# EasyEDA Pro project 延时继电器 - V2.eprj, schematic 原理图
Board Name: 转接隔离板; Create Date: 2024-04-22; Page Name: 主控MCU; Project Name: 延时继电器; Schematic Name: 原理图; Update Date: 2025-04-25; Company: 嘉立创EDA; Page Size: A3; Version: V1.0
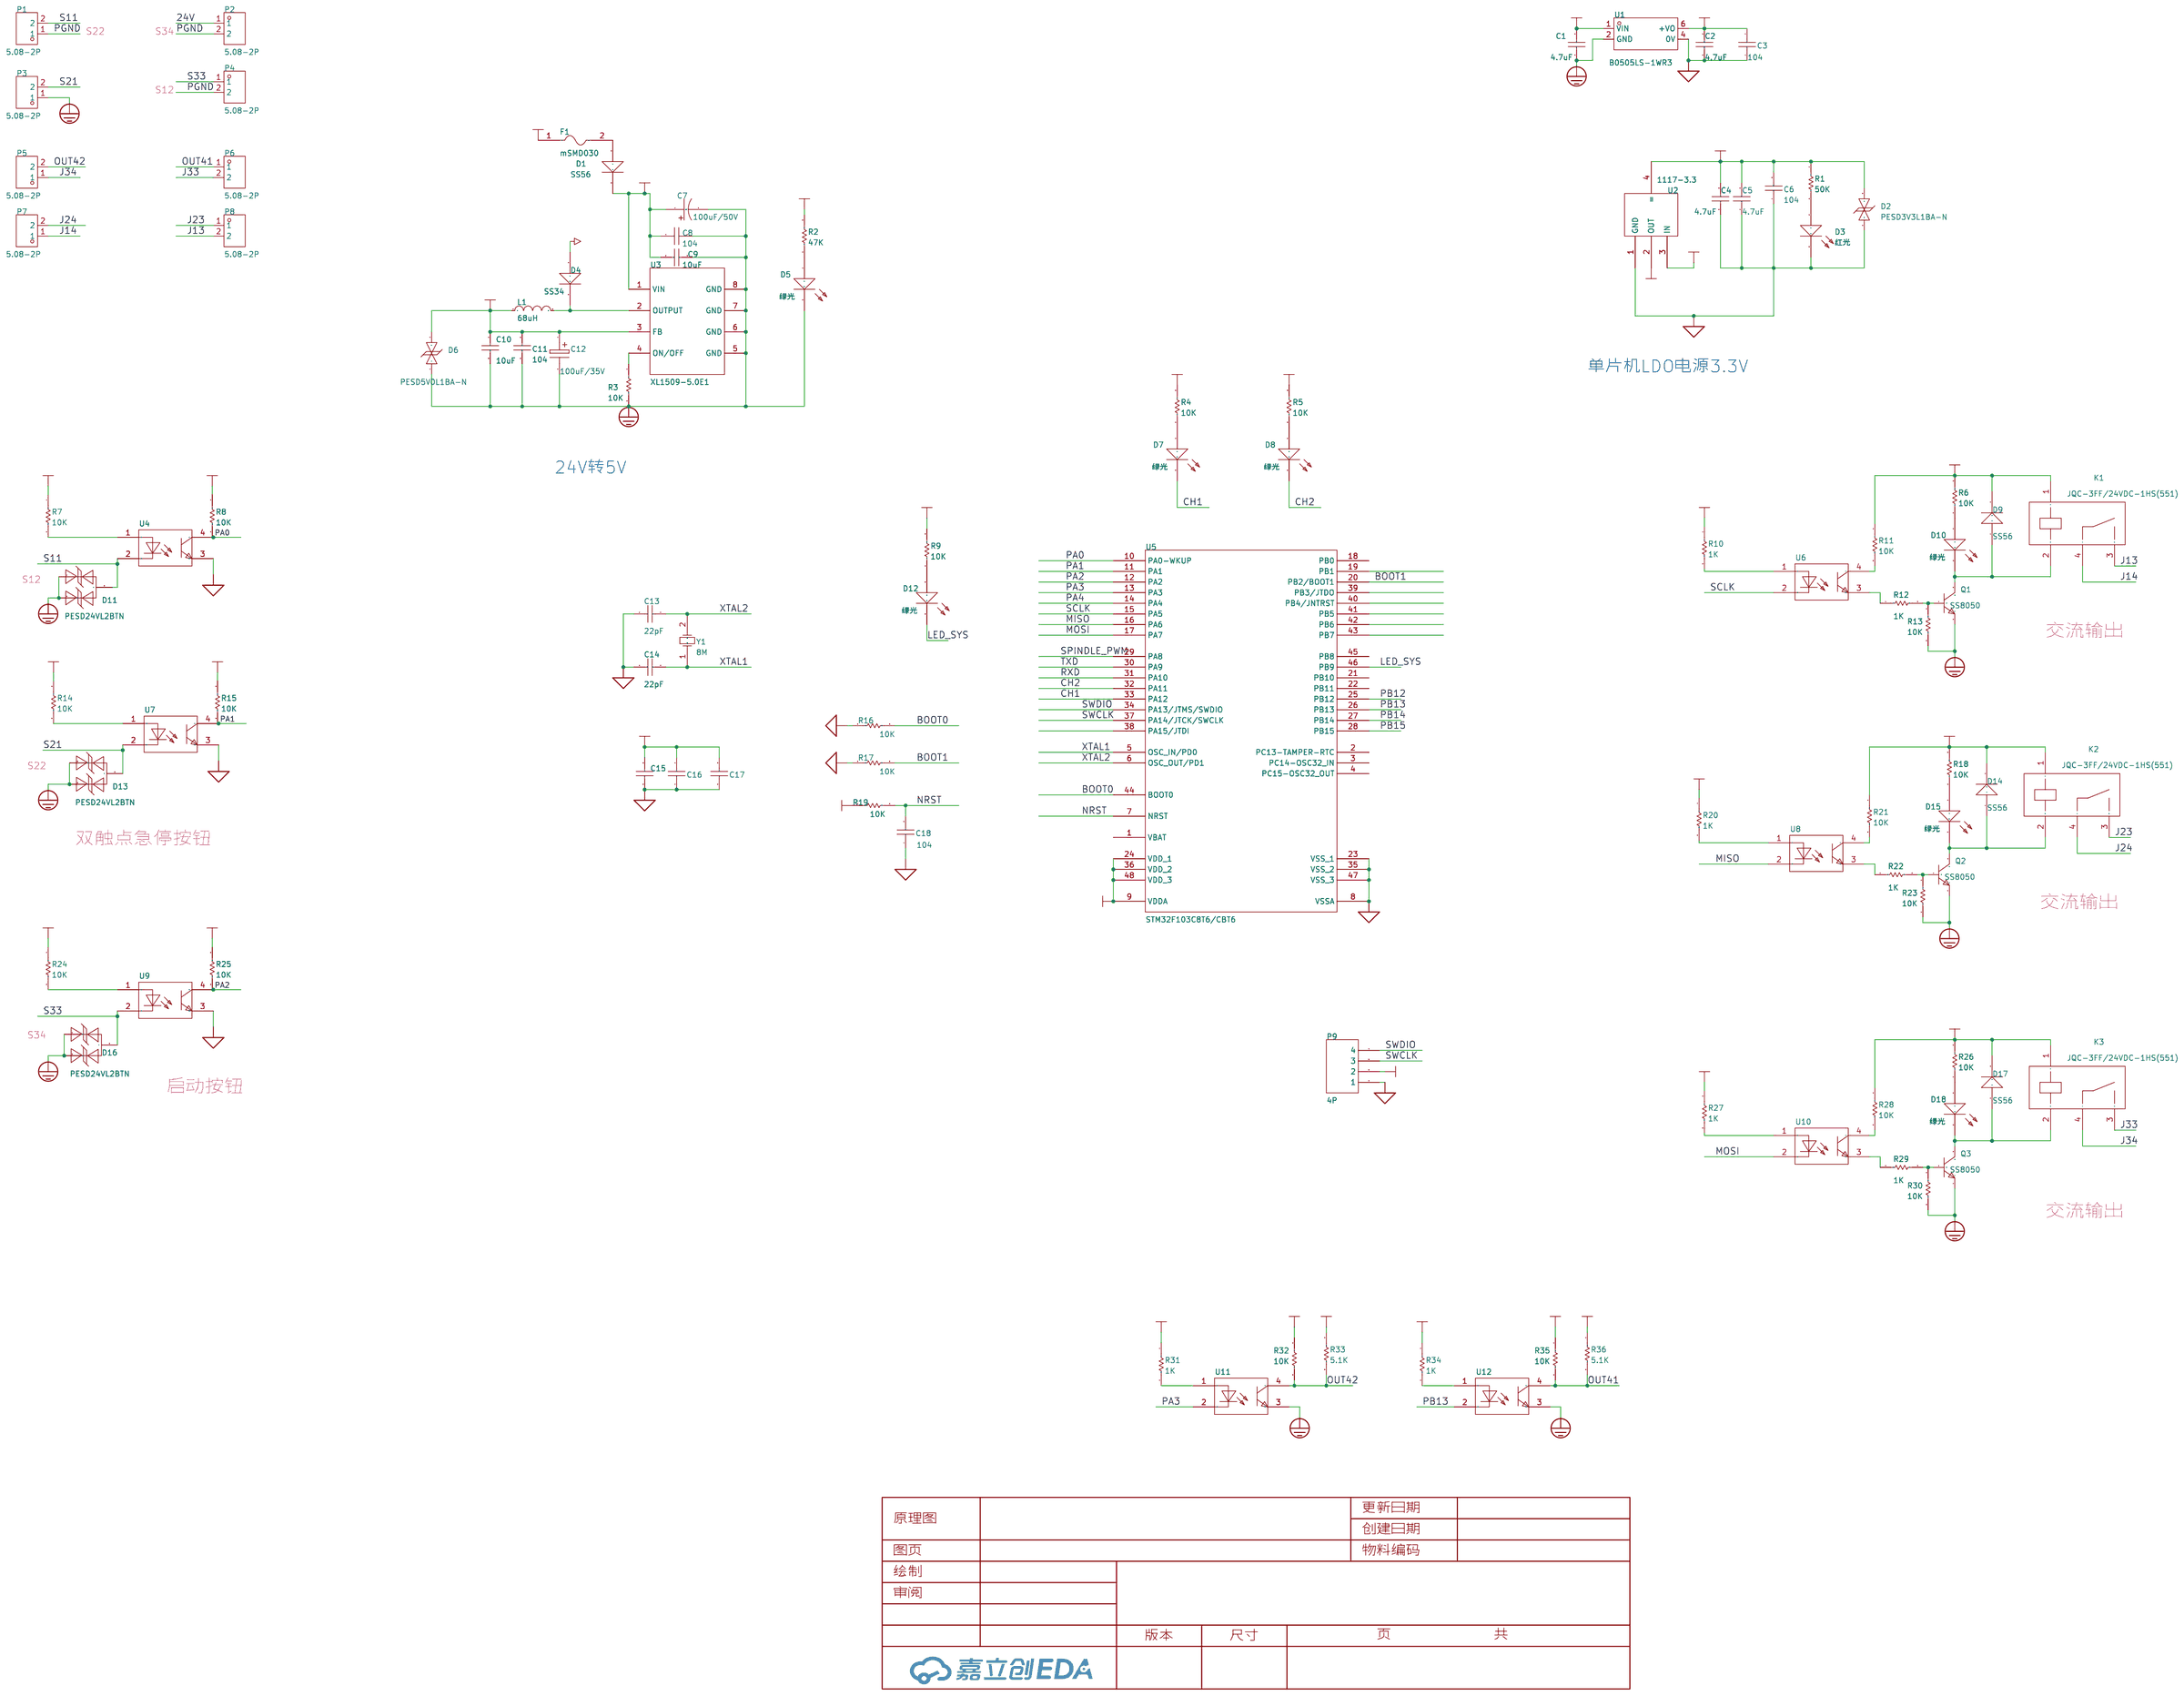
[diagram p0: schematic sheet]

## Parts
C1  4.7uF  [C1206]
C2  4.7uF  [C1206]
C3  104  [C0603]
C4  4.7uF  [C1206]
C5  4.7uF  [C1206]
C6  104  [0603C]
C7  100uF/50V  [CAP-SMD_BD10.0-L10.3-W10.3-LS11.0-R-RD]
C8  104  [0603C]
C9  10uF  [C1206]
C10  10uF  [C1206]
C11  104  [0603C]
C12  100uF/35V  [电解电容贴片6X6]
C13  100pF  [0603C]
C14  100pF  [0603C]
C15  104  [0603C]
C16  104  [0603C]
C17  104  [0603C]
C18  104  [0603C]
D1  SS56  [SMA]
D2  PESD3V3L1BA-N  [SOD-323_L1.8-W1.3-LS2.5-BI]
D3  红光  [0603LED]
D4  SS34  [SMA]
D5  绿光  [0603LED]
D6  PESD5V0L1BA-N  [SOD-323_L1.8-W1.3-LS2.5-BI]
D7  绿光  [0603LED]
D8  绿光  [0603LED]
D9  SS56  [SMA]
D10  绿光  [0603LED]
D11  PESD24VL2BTN  [SOT-23-3_L2.9-W1.6-P1.90-LS2.8-BR]
D12  绿光  [0603LED]
D13  PESD24VL2BTN  [SOT-23-3_L2.9-W1.6-P1.90-LS2.8-BR]
D14  SS56  [SMA]
D15  绿光  [0603LED]
D16  PESD24VL2BTN  [SOT-23-3_L2.9-W1.6-P1.90-LS2.8-BR]
D17  SS56  [SMA]
D18  绿光  [0603LED]
F1  mSMD030  [F1812]
K1  JQC-3FF/24VDC-1HS(551)  [RELAY-TH_JQC-3FF-1HXX]
K2  JQC-3FF/24VDC-1HS(551)  [RELAY-TH_JQC-3FF-1HXX]
K3  JQC-3FF/24VDC-1HS(551)  [RELAY-TH_JQC-3FF-1HXX]
L1  68uH  [IND-SMD_L7.0-W7.0_SMDRI74-330MT]
P1  5.08-2P  [CONN-TH_2P-P5.08_DB128L-5.08-2P]
P2  5.08-2P  [CONN-TH_2P-P5.08_DB128L-5.08-2P]
P3  5.08-2P  [CONN-TH_2P-P5.08_DB128L-5.08-2P]
P4  5.08-2P  [CONN-TH_2P-P5.08_DB128L-5.08-2P]
P5  5.08-2P  [CONN-TH_2P-P5.08_DB128L-5.08-2P]
P6  5.08-2P  [CONN-TH_2P-P5.08_DB128L-5.08-2P]
P7  5.08-2P  [CONN-TH_2P-P5.08_DB128L-5.08-2P]
P8  5.08-2P  [CONN-TH_2P-P5.08_DB128L-5.08-2P]
P9  4P  [SIP4]
Q1  SS8050  [SOT-23-3_L2.9-W1.3-P1.90-LS2.4-BR]
Q2  SS8050  [SOT-23-3_L2.9-W1.3-P1.90-LS2.4-BR]
Q3  SS8050  [SOT-23-3_L2.9-W1.3-P1.90-LS2.4-BR]
R1  50K  [0603R]
R2  47K  [0603R]
R3  10K  [0603R]
R4  10K  [0603R]
R5  10K  [0603R]
R6  10K  [0603R]
R7  10K  [0603R]
R8  10K  [0603R]
R9  10K  [0603R]
R10  1K  [0603R]
R11  10K  [0603R]
R12  1K  [0603R]
R13  10K  [0603R]
R14  10K  [0603R]
R15  10K  [0603R]
R16  10K  [0603R]
R17  10K  [0603R]
R18  10K  [0603R]
R19  10K  [0603R]
R20  1K  [0603R]
R21  10K  [0603R]
R22  1K  [0603R]
R23  10K  [0603R]
R24  10K  [0603R]
R25  10K  [0603R]
R26  10K  [0603R]
R27  1K  [0603R]
R28  10K  [0603R]
R29  1K  [0603R]
R30  10K  [0603R]
R31  1K  [0603R]
R32  10K  [0603R]
R33  10K  [0603R]
R34  1K  [0603R]
R35  10K  [0603R]
R36  10K  [0603R]
U1  B0505LS-1WR3  [PWRM-TH_BXXXXLS-1WR3]
U2  1117-3.3  [SOT-223]
U3  XL1509-5.0E1  [ESOP-8_L4.9-W3.9-P1.27-LS6.0-BL-EP]
U4  LTV-357T-C  [SOP-4_L4.4-W3.9-P2.54-LS7.0-TL]
U5  STM32F103C8T6/CBT6  [LQFP48]
U6  LTV-357T-C  [SOP-4_L4.4-W3.9-P2.54-LS7.0-TL]
U7  LTV-357T-C  [SOP-4_L4.4-W3.9-P2.54-LS7.0-TL]
U8  LTV-357T-C  [SOP-4_L4.4-W3.9-P2.54-LS7.0-TL]
U9  LTV-357T-C  [SOP-4_L4.4-W3.9-P2.54-LS7.0-TL]
U10  LTV-357T-C  [SOP-4_L4.4-W3.9-P2.54-LS7.0-TL]
U11  LTV-357T-C  [SOP-4_L4.4-W3.9-P2.54-LS7.0-TL]
U12  LTV-357T-C  [SOP-4_L4.4-W3.9-P2.54-LS7.0-TL]
Y1  8M  [晶振贴片]

## Library data of the parts
C1-C5 C9 C10 = 104: Design Item ID: CAP; Library Name: SCH--װ--
C6 C8 C11 = 104: Capacitor (Semiconductor SIM Model); Published: 8-Jun-2000; LatestRevisionDate: 17-Jul-2002; LatestRevisionNote: Re-released for DXP Platform.; PackageReference: C1206; Publisher: Altium Limited; Origin Footprint 2: C1206; Origin Footprint 3: 0402; Origin Footprint 4: 1310[0504]; Origin Footprint 5: 1608[0603]; Origin Footprint 6: C1210; Origin Footprint 7: C0805; Origin Footprint 8: C1206; Origin Footprint 9: 0805; Origin Footprint 10: 0805L; Design Item ID: Cap Semi; Library Name: Miscellaneous Devices
C7 = VZH101M1HTR-1008: LCSC Part Name: 100uF ±20% 50V; Supplier Part: C311620; Manufacturer: lelon(立隆); Supplier Footprint: SMD,D10xL7.7mm; JLCPCB Part Class: Extended Part; Datasheet: https://atta.szlcsc.com/upload/public/pdf/source/20180930/C311620_91C90B34A3C1D0C3FD03CD260156F5F6.pdf; Supplier: LCSC; Tolerance: ±20%; Rated Voltage: 50V; φD: 10mm; L: 7.7mm; Lifetime @ Temp: 2000hrs@105℃; Operating Temperature: -45℃~+105℃
C12 = 100uF/35V: Origin Footprint 2: X47U; Origin Footprint 1: 电解电容贴片6x6; Design Item ID: ELECTRO1; Library Name: *
C13 C14 = 22pF: Capacitor (Semiconductor SIM Model); Published: 8-Jun-2000; LatestRevisionDate: 17-Jul-2002; LatestRevisionNote: Re-released for DXP Platform.; PackageReference: C1206; Publisher: Altium Limited; Origin Footprint 2: C1206; Origin Footprint 3: 0402; Origin Footprint 4: 1310[0504]; Origin Footprint 5: 1608[0603]; Origin Footprint 6: C1210; Origin Footprint 7: C0805; Origin Footprint 8: C1206; Origin Footprint 9: 0805; Origin Footprint 10: 0805L; Origin Footprint 11: 0805C; Design Item ID: Cap Semi; Library Name: Miscellaneous Devices
C15-C17 = 104: Origin Footprint 2: CAP; Origin Footprint 3: 0805C; Design Item ID: CAP; Library Name: SCH封装库
C18 = 104: Capacitor (Semiconductor SIM Model); Published: 8-Jun-2000; LatestRevisionDate: 17-Jul-2002; LatestRevisionNote: Re-released for DXP Platform.; PackageReference: C1206; Publisher: Altium Limited; Origin Footprint 2: C1206; Origin Footprint 3: 0402; Origin Footprint 4: 1310[0504]; Origin Footprint 5: 1608[0603]; Origin Footprint 6: C1210; Origin Footprint 7: C0805; Origin Footprint 8: C1206; Origin Footprint 9: 0805; Origin Footprint 10: 0805L; Origin Footprint 11: 0805C; Design Item ID: Cap Semi; Library Name: Miscellaneous Devices
D1 D9 D14 D17 = SS56: Design Item ID: 1N4148; Library Name: SCH封装库
D2 D6 = PESD5V0S1BBN: 极性:Bidirectional;反向关断电压（典型值）:5V (Max);击穿电压（最小值）:6V;箝位电压:15V;峰值脉冲电流（10/1000us）:5A (8/20us);; Supplier Part: C314264; Manufacturer: BORN伯恩半导体; Supplier Footprint: SOD-523; JLCPCB Part Class: Extended Part; Datasheet: https://atta.szlcsc.com/upload/public/pdf/source/20181015/C314264_F9AC5761AC2631DA841FBD1D9C6821E3.pdf; Supplier: LCSC; Polarity: Bidirectional; Voltage - Reverse Standoff (Typ): 5V (Max); Voltage - Breakdown (Min): 6V; Voltage - Clamping (Max) @ Ipp: 15V; Current - Peak Pulse (10/1000μs): 5A (8/20us)
D3 = 红光: Origin Footprint 2: LED(小); Design Item ID: LED; Library Name: SCH封装库
D4 = SS56: Design Item ID: 1N4148; Library Name: SCH--װ--
D5 D7 D8 D10 D12 D15 D18 = 绿光: Origin Footprint 2: LED(小); Design Item ID: LED; Library Name: SCH封装库
D11 D13 D16 = PESD24VL2BTN: Supplier Part: C314266; Manufacturer: BORN伯恩半导体; Supplier Footprint: SOT-23; JLCPCB Part Class: Extended Part; Datasheet: https://atta.szlcsc.com/upload/public/pdf/source/20181015/C314266_827961A24CE19193E9C29A410C67A84F.pdf; Supplier: LCSC; Polarity: Bidirectional; Voltage - Reverse Standoff (Typ): 24V (Max); Voltage - Breakdown (Min): 26.7V; Voltage - Clamping (Max) @ Ipp: 48V; Current - Peak Pulse (10/1000μs): 6A (8/20us)
F1 = mSMD030: 最大电压:30V;最大电流:100A;保持电流:300mA;跳闸电流:600mA;; LCSC Part Name: 0.3A  30V 自恢复保险丝; Supplier Part: C18331; Manufacturer: 台湾陆海; Supplier Footprint: 1812; JLCPCB Part Class: Extended Part; Datasheet: https://atta.szlcsc.com/upload/public/pdf/source/20160331/1459396375099.pdf; Supplier: LCSC; Operating Voltage (Max): 30V; Current Rating (Max): 100A; Hold Current: 300mA; Trip Current: 600mA
K1-K3 = JQC-3FF/24VDC-1HS(551): Supplier Part: C3638; Manufacturer: HF(宏发); Supplier Footprint: 插件; JLCPCB Part Class: Extended Part; Datasheet: https://atta.szlcsc.com/upload/public/pdf/source/20120518/1457706513701.pdf; Supplier: LCSC; Relay Type: General Purpose; Coil Type: Non Latching; Coil Voltage: 24VDC; Contact Form: SPST-NO; Contact Rating (Current): 15A; Switching Voltage: (250VAC , 30VDC) Max
L1 = SMDRI74-330MT: 电感值:33uH;精度:±20%;额定电流:960mA;饱和电流(Isat):1.8A;类型:屏蔽电感;; LCSC Part Name: 33uH±20%1.8A; Supplier Part: C49625; Manufacturer: SXN(顺翔诺); Supplier Footprint: SMD,7.5x7.5mm; JLCPCB Part Class: 扩展库; Datasheet: https://atta.szlcsc.com/upload/public/pdf/source/20210810/6F96FDC19AA308DD2AD166FFB9640E87.pdf; Supplier: LCSC; Tolerance: ±20%; Rated Current: 960mA; Saturation Current (Isat): 1.8A; DC Resistance (DCR): 170mΩ; Type: 屏蔽电感
P1-P8 = DB128L-5.08-2P-GN-S: LCSC Part Name: 5.08mm 排数:1 每排P数:2 直针; Supplier Part: C395868; Manufacturer: DIBO(地博电气); Supplier Footprint: P=5.08mm; JLCPCB Part Class: Extended Part; Datasheet: https://atta.szlcsc.com/upload/public/pdf/source/20190611/C395868_9F3E17C88C37076AB29EAFE95D0B378F.pdf; Supplier: LCSC; Pitch: 5.08mm; Number of Rows: 1; Number of PINs Per Row: 2; Mounting Style: 直针; Current Rating (Max): 18A; Voltage Rating (Max): 250V; Wire Gauge - AWG: 12~30; Wire Gauge - mm?: 2.5; Operating Temperature Range: -40℃~+105℃; Color: 绿色
P9 = 4P: Library Name: SCH--װ--
Q1-Q3 = SS8050: 晶体管类型:NPN;集射极击穿电压(Vceo):25V;集电极电流(Ic):1.5A;功率(Pd):300mW;集电极-发射极饱和电压(VCE(sat)@Ic,Ib):500mV@800mA,80mA;直流电流增益(hFE@Ic,Vce):200@100mA,1V;特征频率(fT):100MHz;工作温度:+150℃@(Tj);; LCSC Part Name: SS8050 Y1 200-350 Y1 200-350; Supplier Part: C2150; Manufacturer: CJ（江苏长电/长晶）; Supplier Footprint: SOT-23(SOT-23-3); JLCPCB Part Class: Basic Part; Datasheet: https://atta.szlcsc.com/upload/public/pdf/source/20140809/1457707209319.pdf; Supplier: LCSC; Transistor Type: NPN; Collector-Emitter Breakdown Voltage (Vceo): 25V; Collector Current (Ic): 1.5A; Power Dissipation (Pd): 300mW; Collector-Emitter Saturation Voltage (VCE(sat)@Ic,Ib): 500mV@800mA,80mA; DC Current Gain (hFE@Ic,Vce): 200@100mA,1V; Transition Frequency (fT): 100MHz; Operating Temperature: +150℃@(Tj)
R1 R2 R4-R6 R9 R18 R26 = 1K: Resistor; Published: 8-Jun-2000; LatestRevisionDate: 17-Jul-2002; LatestRevisionNote: Re-released for DXP Platform.; PackageReference: AXIAL-0.3; Publisher: Altium Limited; Origin Footprint 2: AXIAL-0.3; Origin Footprint 3: R0805; Origin Footprint 4: 0805R; Design Item ID: RES; Library Name: SCH封装库
R3 = 10k: Resistor; Published: 8-Jun-2000; LatestRevisionDate: 17-Jul-2002; LatestRevisionNote: Re-released for DXP Platform.; PackageReference: AXIAL-0.3; Publisher: Altium Limited; Origin Footprint 2: AXIAL-0.3; Origin Footprint 3: R0805; Origin Footprint 4: 0805R; Design Item ID: RES; Library Name: SCH封装库
R7 R10 R12 R14 R20 R22 R24 R27 R29 R31 R34 = 470Ω: Resistor; Published: 8-Jun-2000; LatestRevisionDate: 17-Jul-2002; LatestRevisionNote: Re-released for DXP Platform.; PackageReference: AXIAL-0.3; Publisher: Altium Limited; Origin Footprint 2: AXIAL-0.3; Origin Footprint 3: R0805; Origin Footprint 4: 0805R; Design Item ID: RES; Library Name: SCH封装库
R8 R11 R13 R15 R21 R23 R25 R28 R30 R32 R33 R35 R36 = 10K: Resistor; Published: 8-Jun-2000; LatestRevisionDate: 17-Jul-2002; LatestRevisionNote: Re-released for DXP Platform.; PackageReference: AXIAL-0.3; Publisher: Altium Limited; Origin Footprint 2: AXIAL-0.3; Origin Footprint 3: R0805; Origin Footprint 4: 0805R; Design Item ID: RES; Library Name: SCH封装库
R16 R17 R19 = 10K: Resistor; Published: 8-Jun-2000; LatestRevisionDate: 17-Jul-2002; LatestRevisionNote: Re-released for DXP Platform.; PackageReference: AXIAL-0.3; Publisher: Altium Limited; Origin Footprint 2: AXIAL-0.3; Origin Footprint 3: 0805R; Origin Footprint 4: 0805R; Design Item ID: RES; Library Name: SCH封装库
U1 = B0505LS-1WR3: 100%国产化器件，高可靠性，具备ROHS、REACH、CE认证产品; Supplier Part: C909800; Manufacturer: DEXU(德旭电子); Supplier Footprint: 插件; JLCPCB Part Class: 扩展库; Datasheet: https://atta.szlcsc.com/upload/public/pdf/source/20220506/97E51FF679E86FC18F266BBBBBA200F9.pdf; Supplier: LCSC; Number of channel: 1; input voltage (Vdc): 4.5V~5.5V; Output Voltage: 5V; Output Current (Max): 200mA
U2 = 1117-3.3: Design Item ID: LM1117; Library Name: Party600
U3 = XL1509-5.0E1: 功能类型:降压型;同步整流:-;输出通道数:-;拓扑结构:-;输入电压:-;输出电流(最大值):-;开关频率:-;; LCSC Part Name: 降压型; Supplier Part: C61063; Manufacturer: XLSEMI(芯龙); Supplier Footprint: SOP-8_150mil; JLCPCB Part Class: Basic Part; Datasheet: https://atta.szlcsc.com/upload/public/pdf/source/20151020/1457707483545.pdf; Supplier: LCSC; Function: 降压型
U4 U6-U12 = LTV-357T-C: 输入电压类型:DC;正向电压:1.2V;输出电流:50mA;隔离电压(rms):3.75kV;反向电压:6V;接收端电压:35V;输出通道数:1;集射极饱和电压(Vce(sat)@Ic,IF):200mV@1mA,20mA;; Supplier: LCSC; Manufacturer: LITEON(光宝); Supplier Part: C119091; JLCPCB Part Class: 扩展库; LCSC Part Name: DC输入隔离电压(rms):3750V; Supplier Footprint: SOP-4-2.54mm; Datasheet: https://atta.szlcsc.com/upload/public/pdf/source/20170930/C133128_1506736380934997376.pdf; Input voltage type: DC; Output Type: 光电三极管; Forward Voltage: 1.2V; Output Current: 50mA; Isolation Voltage(rms): 3.75kV; Reverse Voltage: 6V; Receiving End Voltage: 35V; Number of Outputs: 1; Collector-Emitter Saturation Voltage (Vce(sat)@Ic,IF): 200mV@1mA,20mA; Rise time: 4us@2mA,100Ω; Fall time: 3us@2mA,100Ω; Operating Temperature: -55℃~+110℃
U5 = STM32F103C8T6/CBT6: STM32 ARM-based 32-bit MCU with 32 Kbytes Flash, 48-pin LQFP, Industrial Temperature; Published: *; DatasheetVersion: *; PackageVersion: *; PackageReference: *; Publisher: *; PackageDescription: *; ComponentLink1Description: *; ComponentLink1URL: *; ComponentLink2Description: *; ComponentLink2URL: *; Origin Footprint 2: LQFP48_L; Origin Footprint 3: LQFP48_M; Design Item ID: STM32F103C6T6; Library Name: ST Microcontroller 32-Bit STM32 SCH
Y1 = 8M: Crystal Oscillator; Published: 8-Jun-2000; LatestRevisionDate: 17-Jul-2002; LatestRevisionNote: Re-released for DXP Platform.; PackageReference: R38; Publisher: Altium Limited; Origin Footprint 2: R38; Origin Footprint 3: XTAL-49S; Design Item ID: XTAL; Library Name: Miscellaneous Devices

## Nets
3V3: C4.2 C5.2 C6.2 C15.2 C16.2 C17.2 D2.2 P9.2 R1.1 R4.2 R5.2 R8.1 R9.2 R10.1 R15.1 R19.1 R20.1 R25.1 R27.1 R31.1 R34.1 U2.2(OUT) U2.4(=) U5.9(VDDA) U5.24(VDD_1) U5.36(VDD_2) U5.48(VDD_3)
5V_MCU: C2.2 C3.2 U1.6(+VO) U2.3(IN)
5V_VCC: C1.2 C10.1 C11.2 C12.1 D6.2 L1.1 R33.1 R36.1 U1.1(VIN) U3.3(FB)
24V: F1.1 P2.1
GND: D4.1
PGND: C1.1 C7.2 C8.1 C9.1 C10.2 C11.1 C12.2 D5.2 D6.1 D11.1(K) D11.2(K) D13.1(K) D13.2(K) D16.1(K) D16.2(K) P1.1 P2.2 P3.1 P4.2 Q1.2(E) Q2.2(E) Q3.2(E) R3.2 R13.2 R23.2 R30.2 U1.2(GND) U3.5(GND) U3.6(GND) U3.7(GND) U3.8(GND) U11.3 U12.3
SGND: C2.1 C3.1 C4.1 C5.1 C6.1 C13.2 C14.2 C15.1 C16.1 C17.1 C18.1 D2.1 D3.2 P9.1 R16.1 R17.1 U1.4(0V) U2.1(GND) U4.3 U5.8(VSSA) U5.23(VSS_1) U5.35(VSS_2) U5.47(VSS_3) U7.3 U9.3
VIN_24V: C7.1 C8.2 C9.2 D1.2 D9.2 D14.2 D17.2 K1.1 K2.1 K3.1 R2.2 R6.2 R7.1 R11.1 R14.1 R18.2 R21.1 R24.1 R26.2 R28.1 R32.1 R35.1 U3.1(VIN)
BOOT0: R16.2 U5.44(BOOT0)
BOOT1: R17.2 U5.20(PB2/BOOT1)
CH1: D7.2 U5.33(PA12)
CH2: D8.2 U5.32(PA11)
J13: K1.3 P8.2
J14: K1.4 P7.1
J23: K2.3 P8.1
J24: K2.4 P7.2
J33: K3.3 P6.2
J34: K3.4 P5.1
LED_SYS: D12.2 U5.46(PB9)
MISO: U5.16(PA6) U8.2
MOSI: U5.17(PA7) U10.2
NRST: C18.2 R19.2 U5.7(NRST)
OUT41: P6.1 R35.2 R36.2 U12.4
OUT42: P5.2 R32.2 R33.2 U11.4
PA0: R8.2 U4.4 U5.10(PA0-WKUP)
PA1: R15.2 U5.11(PA1) U7.4
PA2: R25.2 U5.12(PA2) U9.4
PA3: U5.13(PA3) U11.2
PA4: U5.14(PA4)
PB12: U5.25(PB12)
PB13: U5.26(PB13) U12.2
PB14: U5.27(PB14)
PB15: U5.28(PB15)
RXD: U5.31(PA10)
S11: D11.3(A) P1.2 U4.2
S21: D13.3(A) P3.2 U7.2
S33: D16.3(A) P4.1 U9.2
SCLK: U5.15(PA5) U6.2
SPINDLE_PWM: U5.29(PA8)
SWCLK: P9.3 U5.37(PA14/JTCK/SWCLK)
SWDIO: P9.4 U5.34(PA13/JTMS/SWDIO)
TXD: U5.30(PA9)
XTAL1: C14.1 U5.5(OSC_IN/PD0) Y1.1(OSC1)
XTAL2: C13.1 U5.6(OSC_OUT/PD1) Y1.2(OSC2)
$1N53807: D12.1 R9.1
$1N53854: R24.2 U9.1
$1N55881: D3.1 R1.2
$1N58958: R7.2 U4.1
$1N59162: R14.2 U7.1
$1N59368: R10.2 U6.1
$1N59371: R11.2 U6.4
$1N59536: R12.1 U6.3
$1N59597: D10.1 R6.1
$1N59599: Q1.1(B) R12.2 R13.1
$1N59629: D9.1 D10.2 K1.2 Q1.3(C)
$1N60118: R20.2 U8.1
$1N60120: R21.2 U8.4
$1N60129: R22.1 U8.3
$1N60134: D15.1 R18.1
$1N60136: Q2.1(B) R22.2 R23.1
$1N60139: D14.1 D15.2 K2.2 Q2.3(C)
$1N60524: R27.2 U10.1
$1N60526: R28.2 U10.4
$1N60535: R29.1 U10.3
$1N60540: D18.1 R26.1
$1N60542: Q3.1(B) R29.2 R30.1
$1N60545: D17.1 D18.2 K3.2 Q3.3(C)
$1N62788: D7.1 R4.1
$1N64965: R31.2 U11.1
$1N65241: R34.2 U12.1
$1N65547: D8.1 R5.1
$1N72390: D4.2 L1.2 U3.2(OUTPUT)
$1N72392: R3.1 U3.4(ON/OFF)
$1N72469: D1.1 F1.2
$1N72730: D5.1 R2.1

Not connected (* = marked no-connect by the designer): U5 1(VBAT) 2(PC13-TAMPER-RTC) 3(PC14-OSC32_IN) 4(PC15-OSC32_OUT) 18(PB0) 19(PB1) 21(PB10) 22(PB11) 38(PA15/JTDI) 39(PB3/JTDO) 40(PB4/JNTRST) 41(PB5) 42(PB6) 43(PB7) 45(PB8)

## Notes on the sheet
- S22
- S34
- S12
- 单片机LDO电源3.3V
- 24V转5V
- S12
- 交流输出
- S22
- 双触点急停按钮
- 交流输出
- S34
- 启动按钮
- 交流输出
